# EAGLE design Schematic (EAGLE 6.5.0)
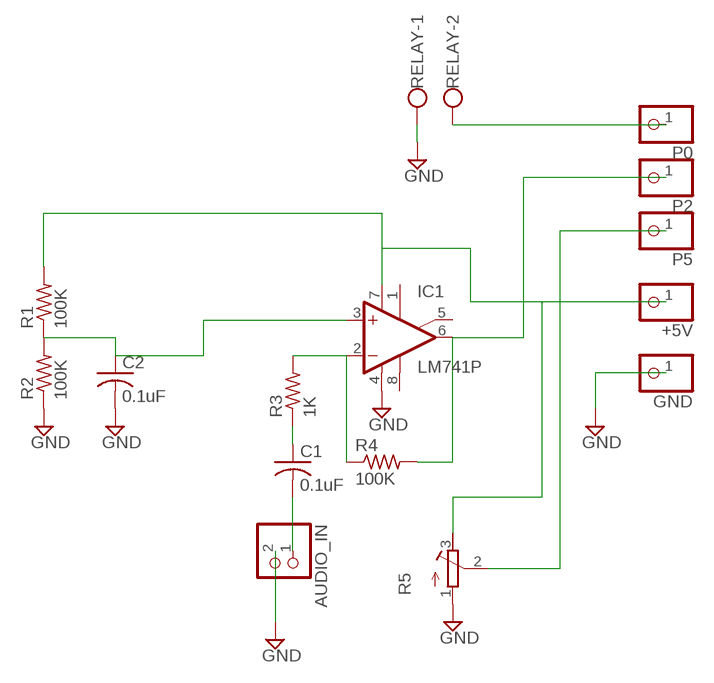
[diagram p0: schematic, sheet 1]

## Parts
+5V  PINHD-1X1  [1X01]
AUDIO_IN  PINHD-1X2  [1X02]
C1  0.1uF  C-US025-024X044  [C025-024X044]
C2  0.1uF  C-US025-024X044  [C025-024X044]
GND  PINHD-1X1  [1X01]
IC1  LM741P  [DIL08]
P0  PINHD-1X1  [1X01]
P2  PINHD-1X1  [1X01]
P5  PINHD-1X1  [1X01]
R1  100K  R-US_0207/2V  [0207/2V]
R2  100K  R-US_0207/2V  [0207/2V]
R3  1K  R-US_0207/2V  [0207/2V]
R4  100K  R-US_0207/2V  [0207/2V]
R5  R-TRIMM64W  [RTRIM64W]
RELAY  W237-102  [W237-102]

## Nets
GND: AUDIO_IN.2 C2.2 GND.1 IC1.4(V-) R2.1 R5.1(E) RELAY.1
N$1: C1.1 R3.1
N$2: C2.1 IC1.3(+IN) R1.1 R2.2
N$3: AUDIO_IN.1 C1.2
N$4: IC1.2(-IN) R3.2 R4.1
N$5: IC1.6(OUT) P2.1 R4.2
N$6: +5V.1 IC1.7(V+) R1.2 R5.3(A)
N$7: P0.1 RELAY.2
N$9: P5.1 R5.2(S)
Unconnected: IC1.1(ON1) IC1.5(ON2) IC1.8(OPT)

## Library data of the parts
+5V GND P0 P2 P5 = pinhead:PINHD-1X1: PIN HEADER
AUDIO_IN = pinhead:PINHD-1X2: PIN HEADER
C1 C2 = rcl:C-US: CAPACITOR, American symbol
IC1 = linear:*741: OP AMP
R1-R4 = resistor:R-US_: RESISTOR, American symbol
R5 = resistor:R-TRIMM: Trimm resistor
RELAY = con-wago-500:W237-102: WAGO SCREW CLAMP; MPN: 237-102; OC_FARNELL: unknown; OC_NEWARK: 70K9898

## Board
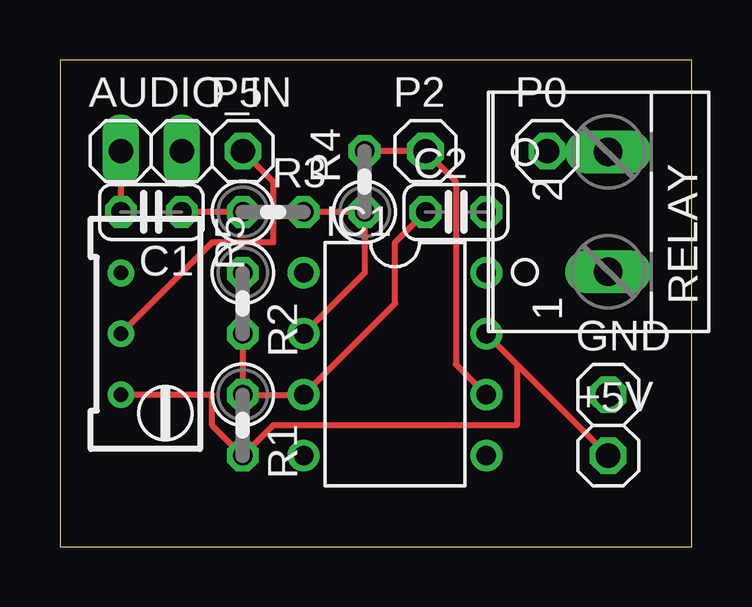
[diagram p1: board, top side]
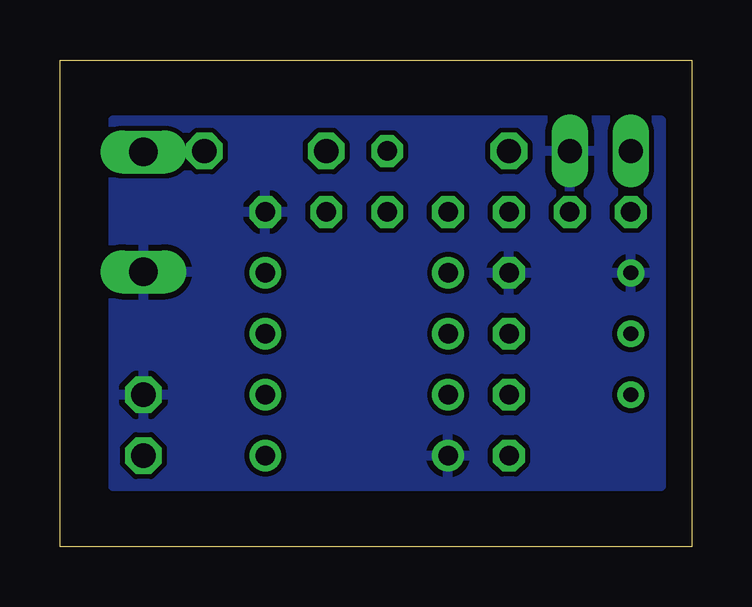
[diagram p2: board, bottom side, seen from below]

Size 26.34 x 20.31 mm. Coordinates in mm from the lower left corner, seen from the top.
Outline: 0,0 26.34,0 26.34,20.31 0,20.31 0,0
Copper layers (1*16): Top 0.035mm / dielectric 1.5mm / Bottom 0.035mm
Design rules "default": minimum track width 10mil, minimum drill 24mil, track to track 8mil, track to pad 8mil, pad to pad 8mil, via to via 8mil, smd to smd 8mil, copper to edge 40mil, drill to drill 8mil, minimum pad ring 10mil, minimum via ring 8mil, stop-mask expansion 4mil, vias tented up to drill 0mil, thermal gap 10mil

### Footprints (pad centres in the part's own frame; a part is rotated, then mirrored left to right if it is on the bottom)
1X01 = drill 1.016 octagon: 1 0,0
1X02 = drill 1.016 long: 1 -1.27,0; 2 1.27,0
C025-024X044 = drill 0.813 octagon: 1 -1.27,0; 2 1.27,0
DIL08 = drill 0.813 pad 1.27: 1 -3.81,-3.81; 2 -1.27,-3.81; 3 1.27,-3.81; 4 3.81,-3.81; 5 3.81,3.81; 6 1.27,3.81; 7 -1.27,3.81; 8 -3.81,3.81
0207/2V = drill 0.813 octagon: 1 -1.27,0; 2 1.27,0
RTRIM64W = drill 0.61: 1 1.27,-2.54; 2 1.27,0; 3 1.27,2.54
W237-102 = drill 1.194 long: 1 -2.5,-1.27; 2 2.5,-1.27

### Placement (x,y rotation side)
+5V  22.86,3.81 0 top
AUDIO_IN  3.81,16.51 0 top
C1  3.81,13.97 180 top
C2  16.51,13.97 0 top
GND  22.86,6.35 0 top
IC1  13.97,7.62 270 top
P0  20.32,16.51 0 top
P2  15.24,16.51 0 top
P5  7.62,16.51 0 top
R1  7.62,5.08 270 top
R2  7.62,10.16 270 top
R3  8.89,13.97 0 top
R4  12.7,15.24 90 top
R5  3.81,8.89 180 top
RELAY  21.59,13.97 90 top

### Tracks (layer width: path | path; a pad name or v marks a point on that pad's centre or on a via)
GND
  pour Bottom: 1.27,17.78 24.13,17.78 24.13,2.54 1.27,2.54
N$1
  Top 0.254: R3.1 C1.1
N$2
  Top 0.254: R2.2 R1.1 IC1.3 13.97,10.16 13.97,12.7 C2.1
N$3
  Top 0.254: AUDIO_IN.1 C1.2
N$4
  Top 0.254: IC1.2 12.7,11.43 R4.1 R3.2
N$5
  Top 0.254: IC1.6 16.51,7.62 16.51,15.24 P2.1 R4.2
N$6
  Top 0.254: R5.3 6.35,6.35 6.35,5.08 R1.2 8.89,5.08 19.05,5.08 19.05,7.62 | +5V.1 19.05,7.62 | 19.05,7.62 IC1.7
N$7
  Top 0.254: P0.1 22.86,16.51 RELAY.2
N$9
  Top 0.254: R5.2 6.35,12.7 8.89,12.7 8.89,15.24 P5.1